# Altium schematic sheet Voltage_Regulators_78xx_Figure 1.SchDoc
size 96 x 43 mm
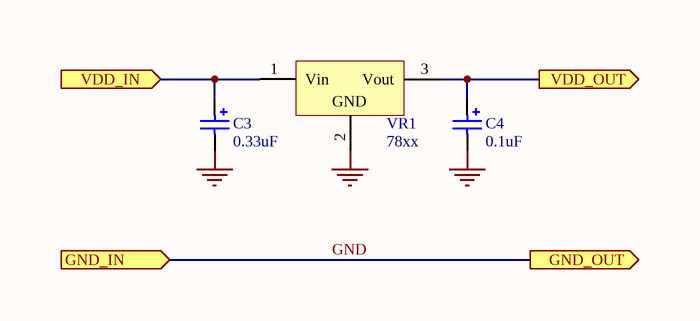
[diagram p0: Voltage_Regulators_78xx_Figure 1.SchDoc]

## Parts
C3  value 0.33uF  [CAPPR2.5-6.3x5]  (hidden comment: Cap Pol1)
C4  value 0.1uF  [CAPPR2.5-6.3x5]  (hidden comment: Cap Pol1)
VR1  value 78xx  [TO257H]  (hidden comment: Volt Reg)

## Ports
GND_IN (in), GND_OUT (out), VDD_IN (in), VDD_OUT (out)

## Nets
GND: C3.2 C4.2 VR1.2(GND) ; port GND_IN, port GND_OUT
VDD_IN: C3.1 VR1.1(Vin) ; port VDD_IN
VDD_OUT: C4.1 VR1.3(Vout) ; port VDD_OUT

## Library data of the parts
C3 C4 = Cap Pol1: Polarized Capacitor (Radial); Manufacturer: Generic Components; Class I: Passive; Published: 8-Jun-2000; Revision: July-2002: Re-released for DXP Platform.; Publisher: Altium Limited; Class II: Capacitor
VR1 = Volt Reg: Voltage Regulator; Manufacturer: Generic Components; Class I: Power Management; Published: 24-Mar-1999; Revision: July-2002: Re-released for DXP Platform.; Publisher: Altium Limited; Class II: Voltage Regulator